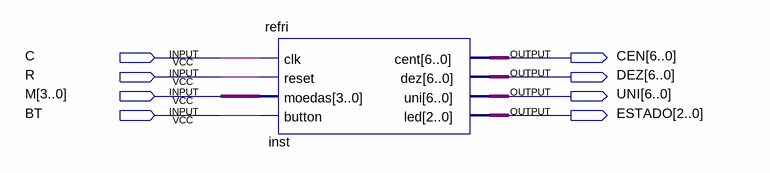
[diagram p0: schematic sheet]
// Quartus schematic maquinaDeVendas.bdf as structural Verilog: 1 symbols, 8 pins
module maquinaDeVendas (
  input  C,
  input  R,
  input  [3:0] M,
  input  BT,
  output [6:0] CEN,
  output [6:0] DEZ,
  output [6:0] UNI,
  output [2:0] ESTADO
);

  refri inst (.clk(C), .reset(R), .moedas(M), .button(BT), .cent(CEN), .dez(DEZ), .uni(UNI), .led(ESTADO));
endmodule
